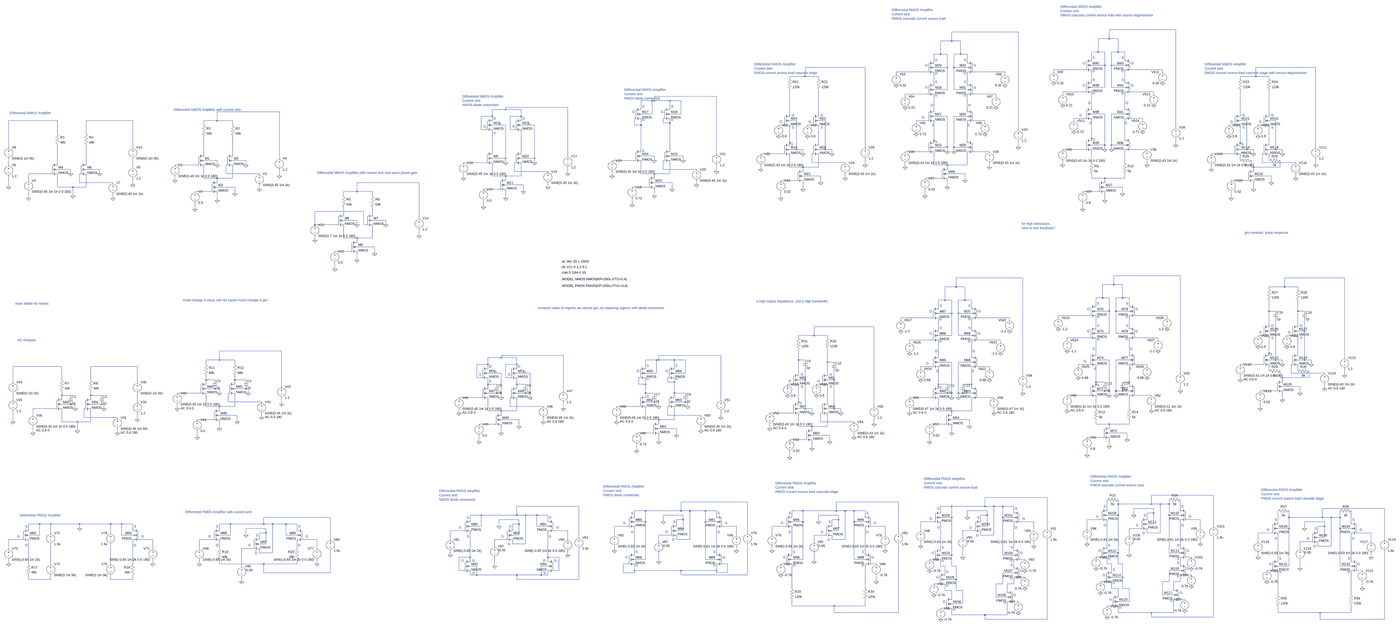
[diagram p0: schematic Draft3.asc, whole sheet]
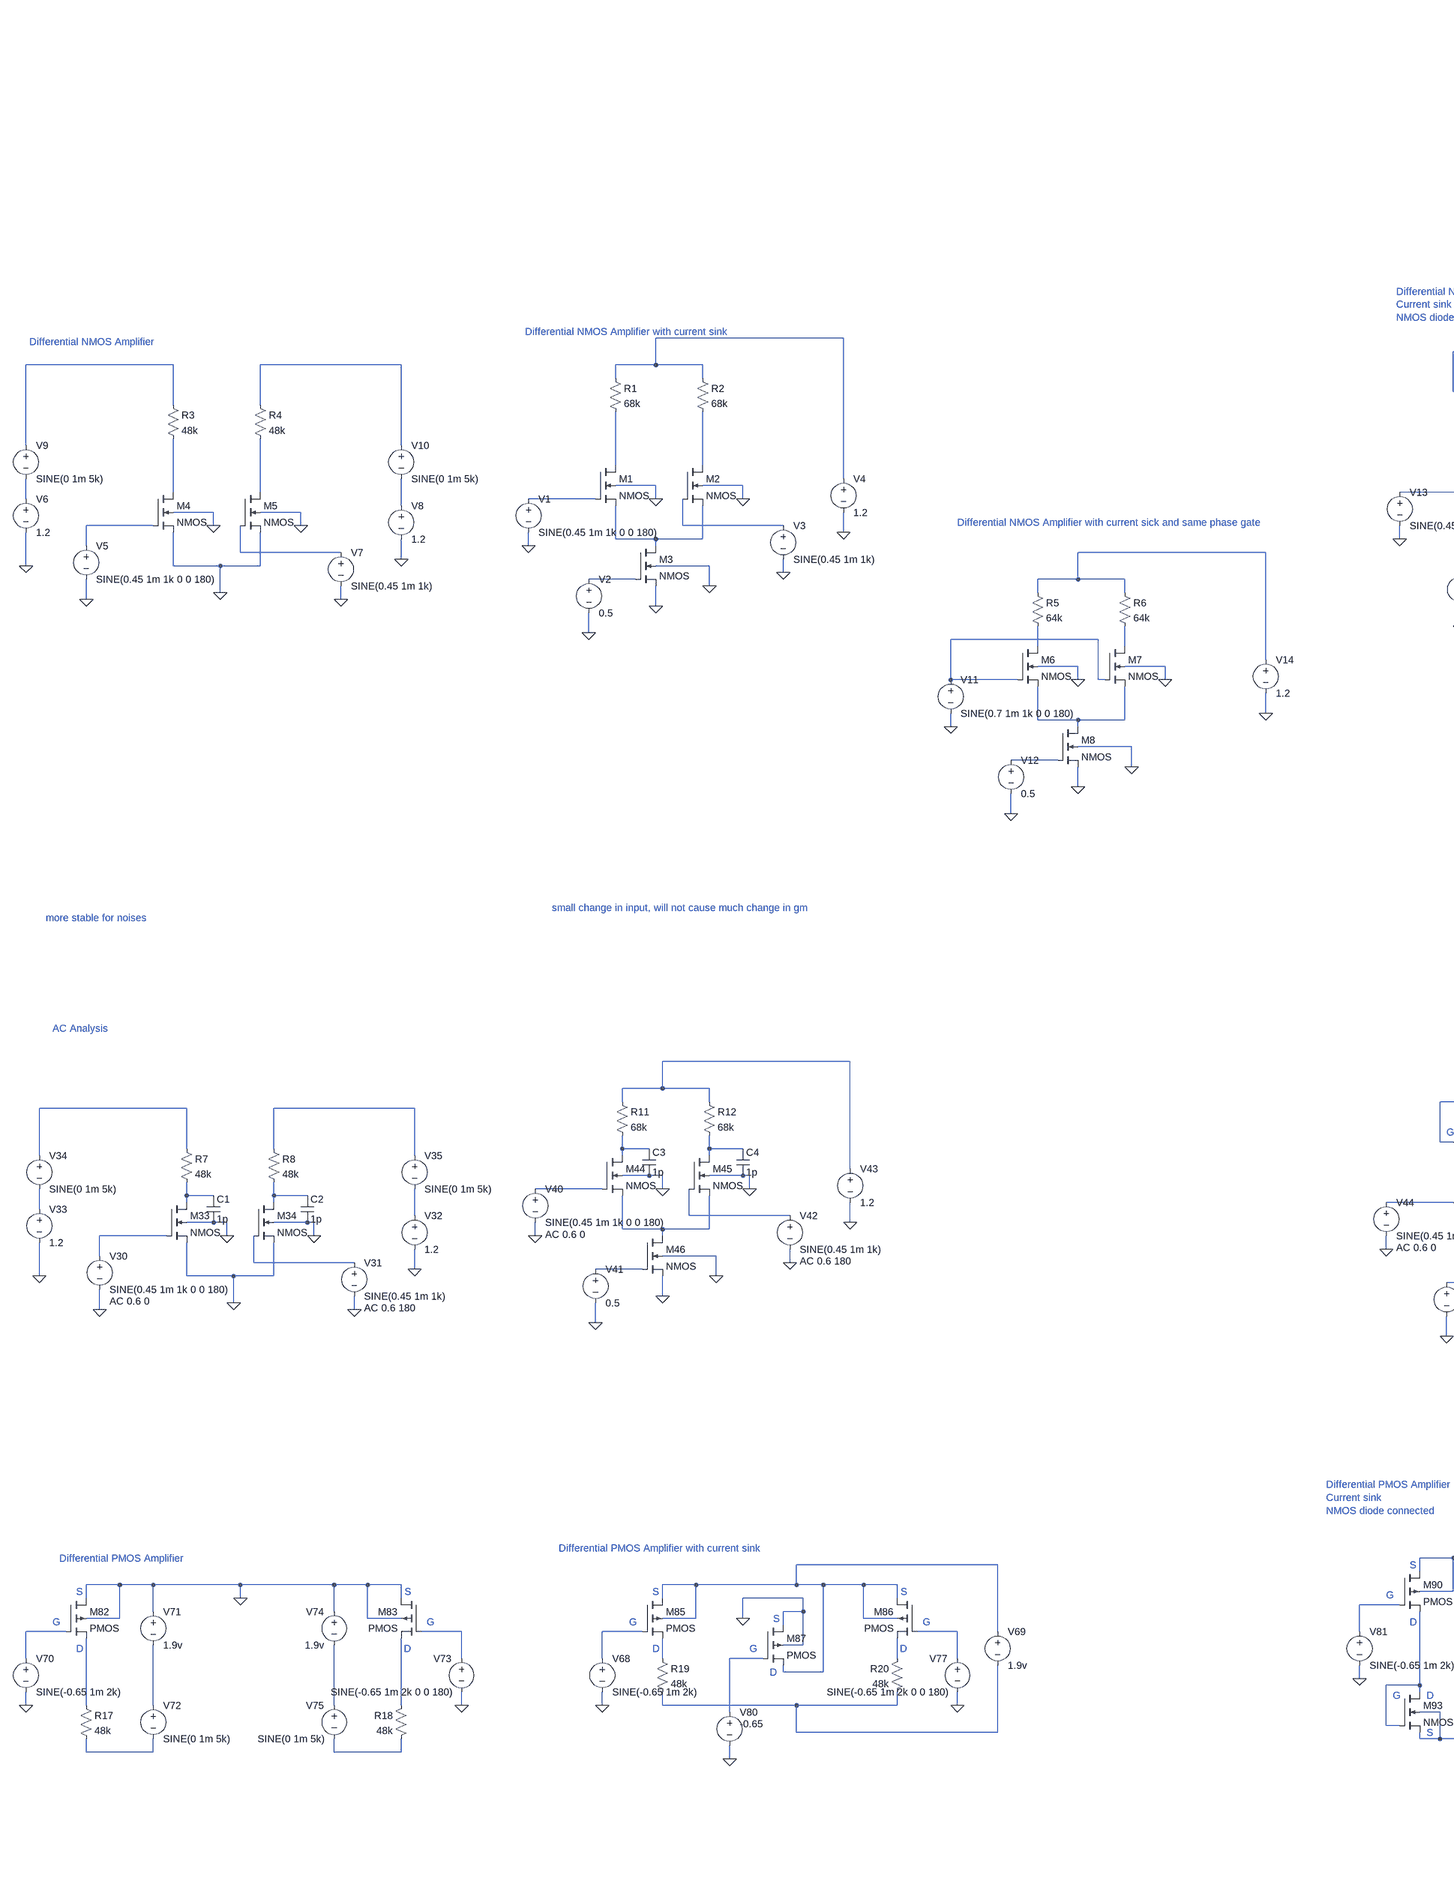
[diagram p1: schematic Draft3.asc, part, row 1 of 1, column 1 of 3]
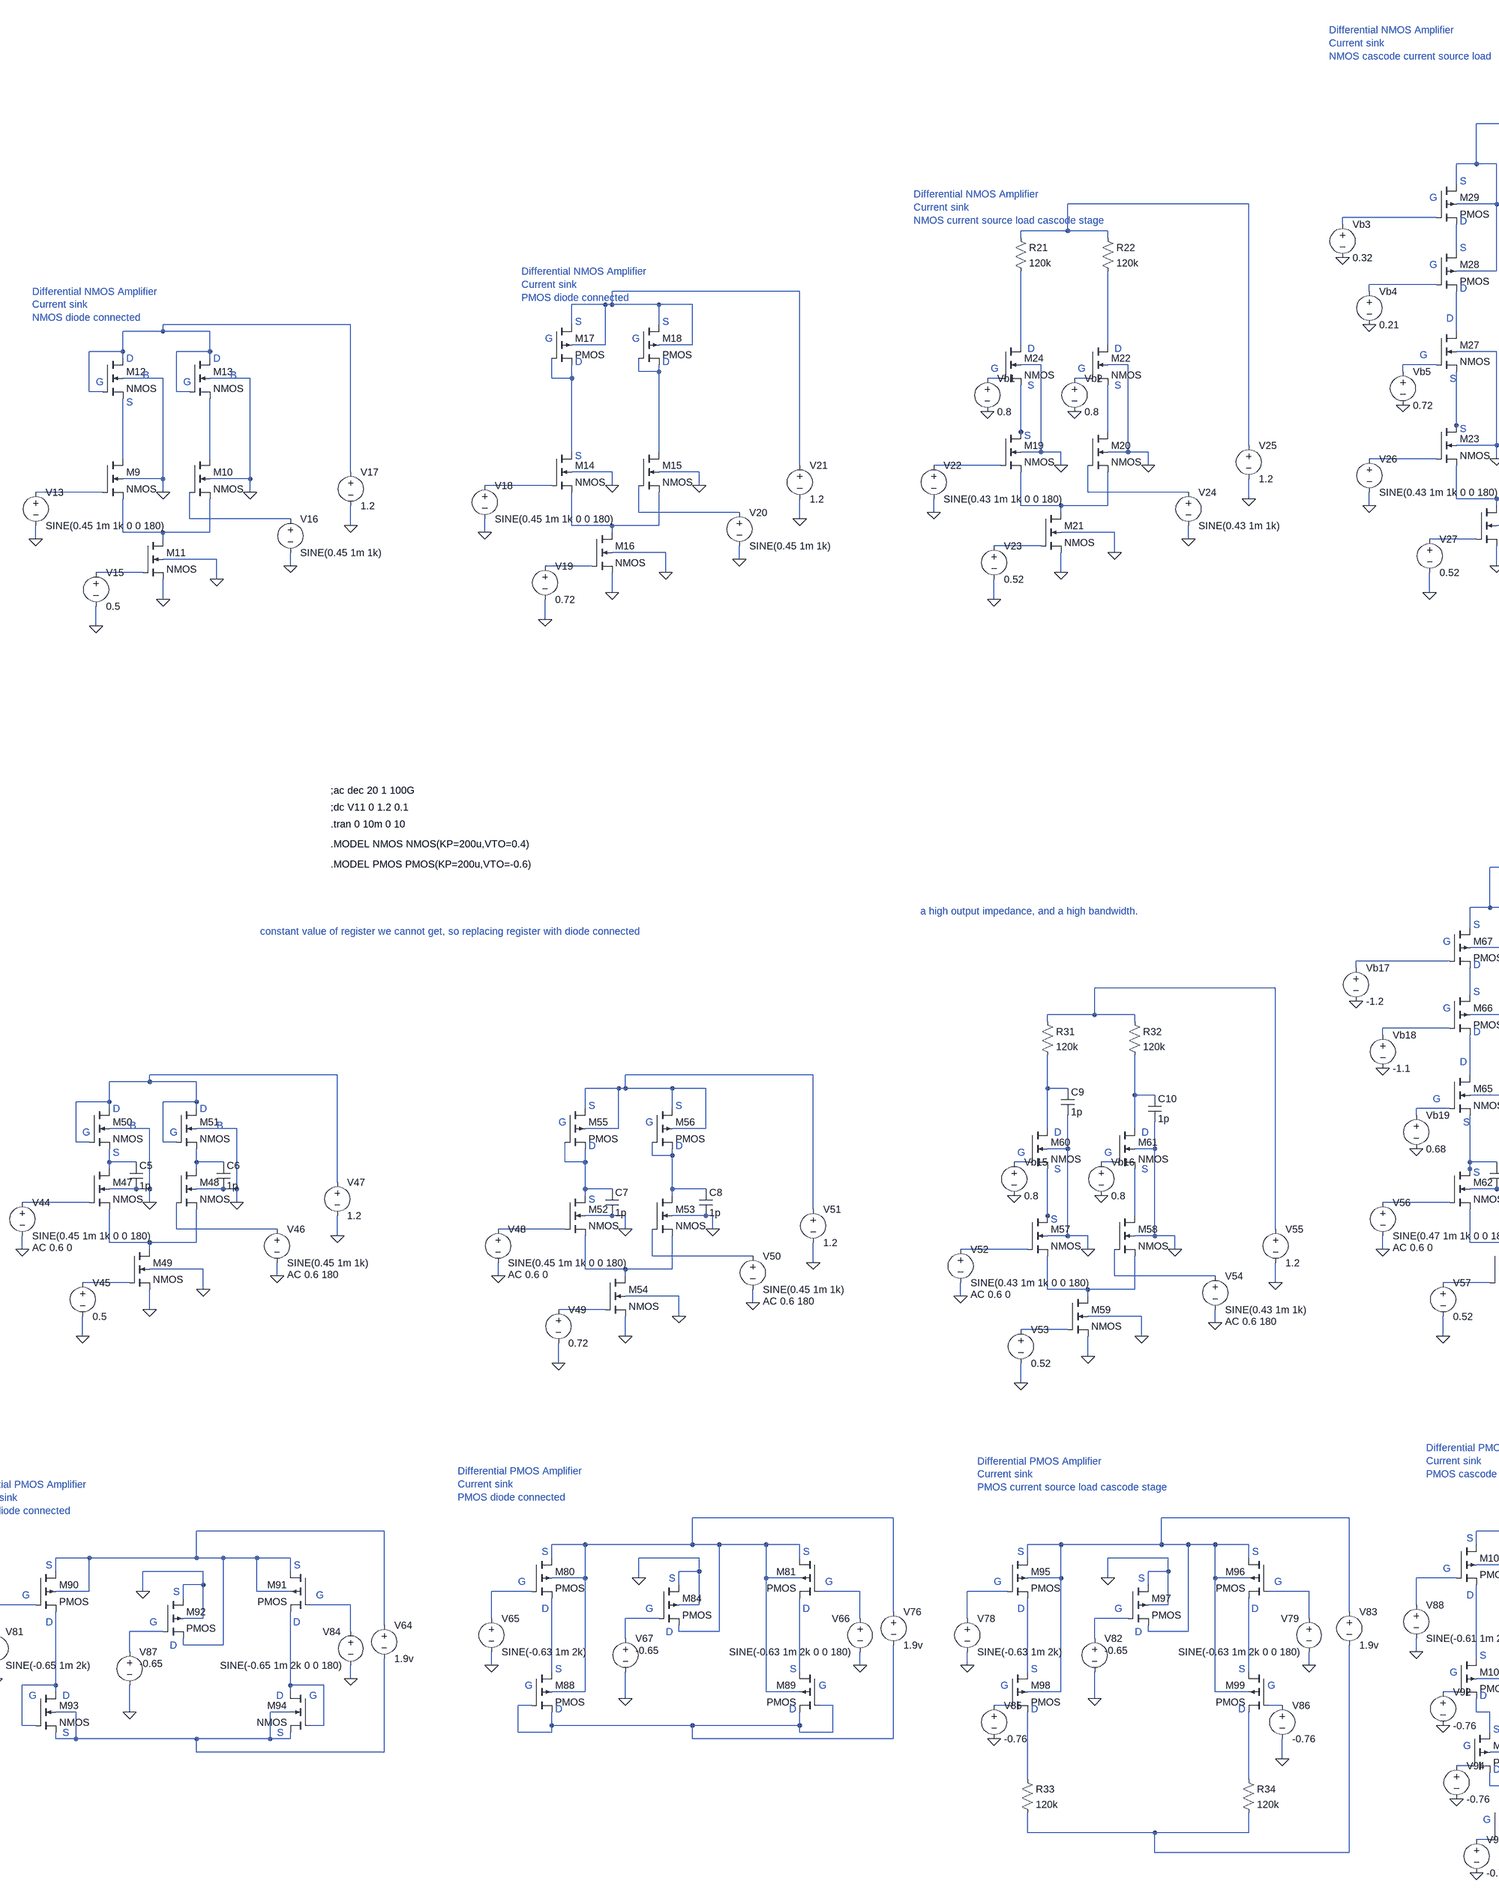
[diagram p2: schematic Draft3.asc, part, row 1 of 1, column 2 of 3]
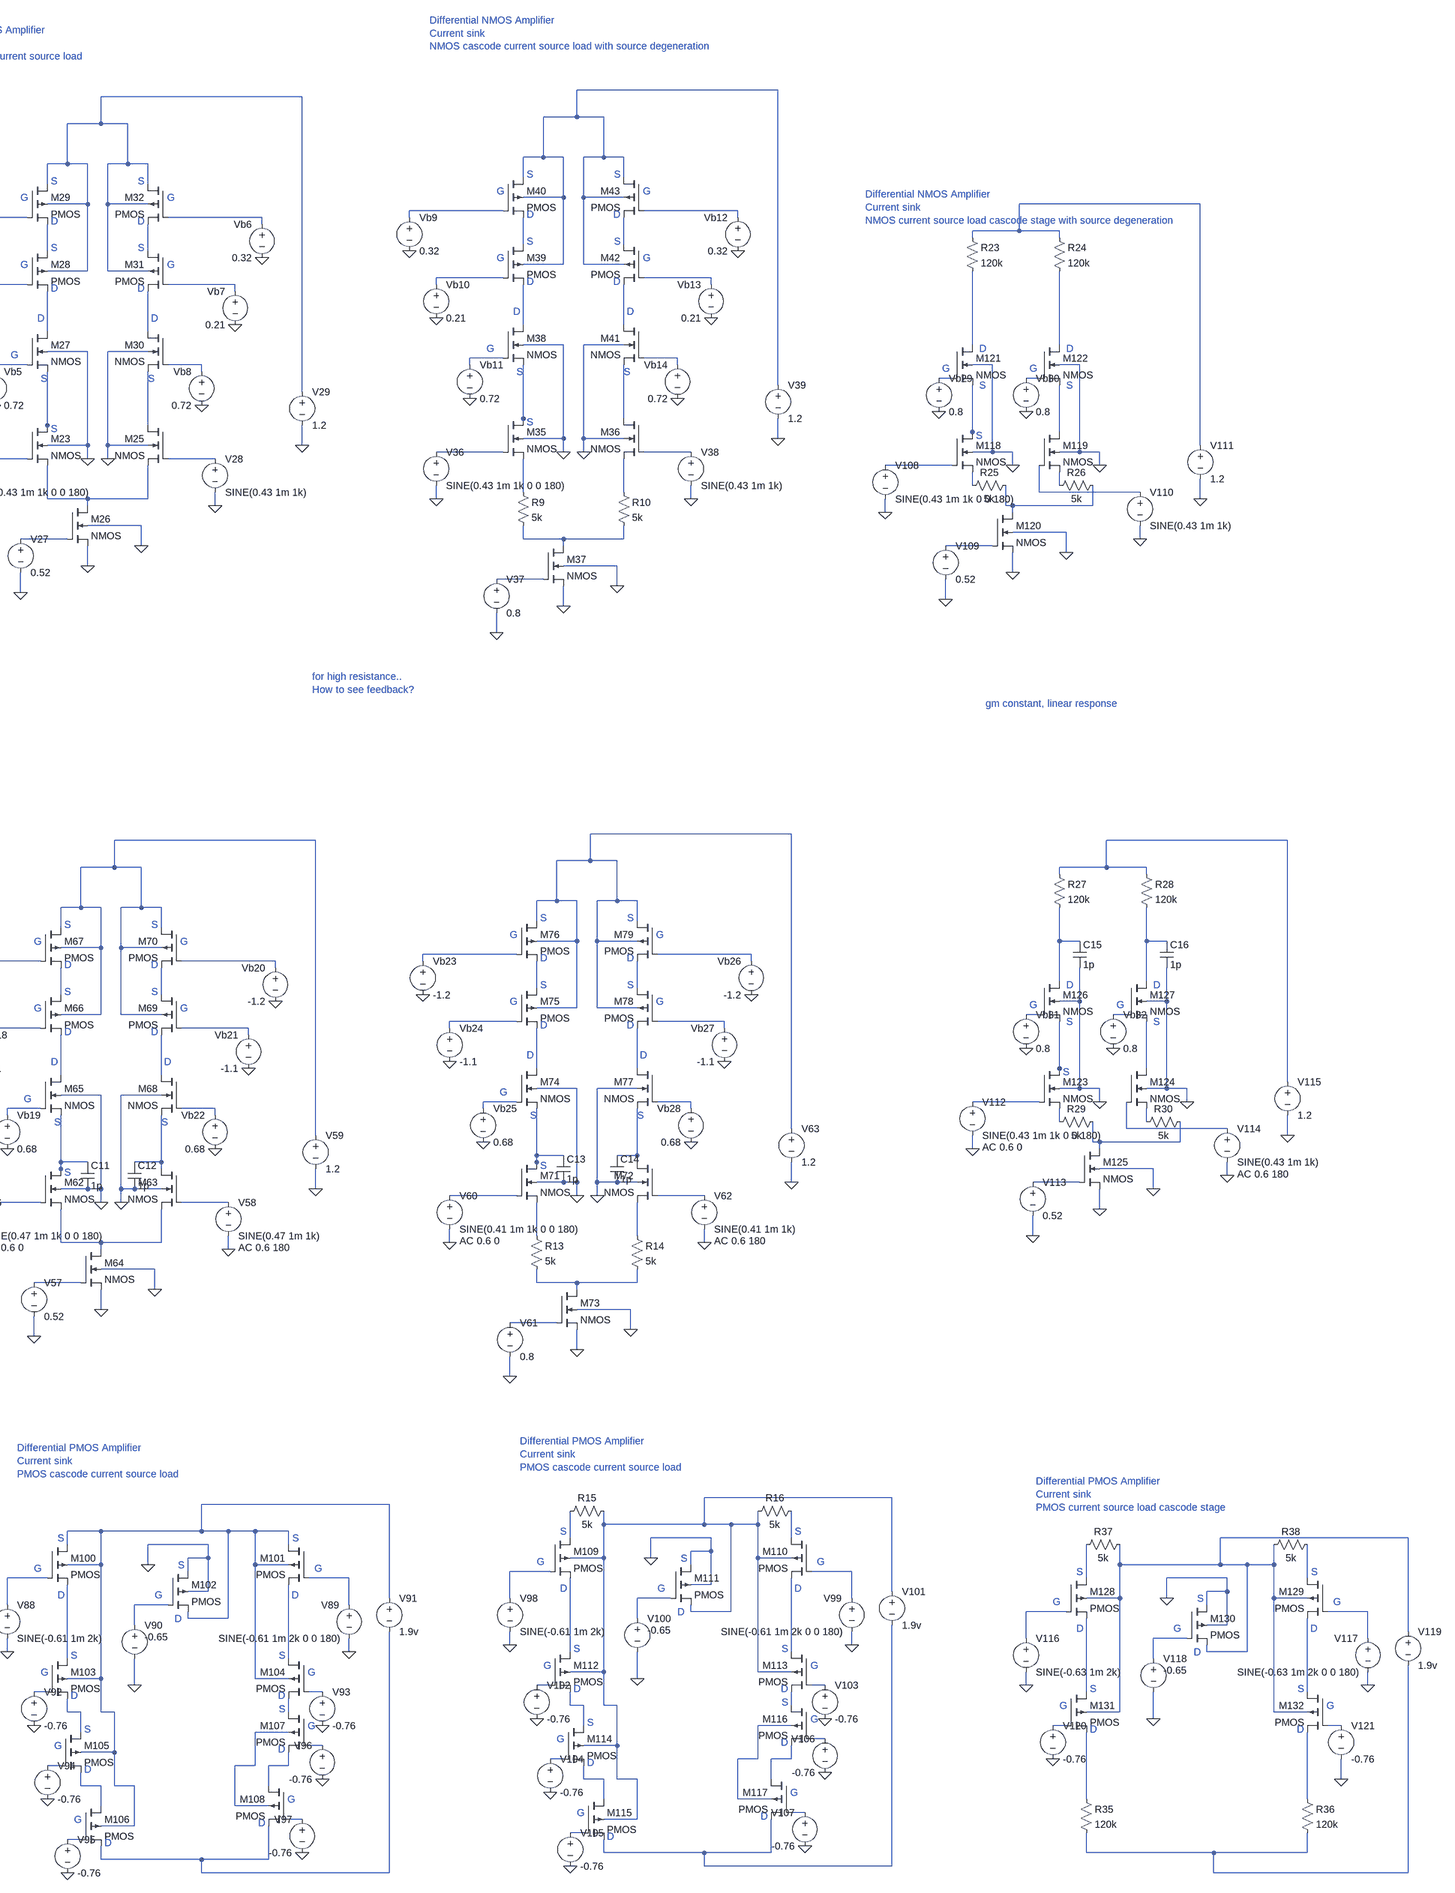
[diagram p3: schematic Draft3.asc, part, row 1 of 1, column 3 of 3]
* Draft3.asc
M1 N054 N069 N080 0 NMOS l=1u w=60u
M2 N055 N077 N080 0 NMOS l=1u w=60u
M3 N080 N089 0 0 NMOS
V1 N069 0 SINE(0.45 1m 1k 0 0 180)
V2 N089 0 0.5
V3 N077 0 SINE(0.45 1m 1k)
V4 N023 0 1.2
R1 N023 N054 68k
R2 N023 N055 68k
M4 N061 N076 0 0 NMOS l=1u w=60u
M5 N062 N085 0 0 NMOS l=1u w=60u
V5 N076 0 SINE(0.45 1m 1k 0 0 180)
V7 N085 0 SINE(0.45 1m 1k)
V8 N071 0 1.2
R3 N030 N061 48k
R4 N031 N062 48k
V6 N068 0 1.2
V9 N030 N068 SINE(0 1m 5k)
V10 N031 N071 SINE(0 1m 5k)
M6 N092 N091 N094 0 NMOS l=1u w=100u
M7 N093 N091 N094 0 NMOS l=1u w=100u
M8 N094 N095 0 0 NMOS
V11 N091 0 SINE(0.7 1m 1k 0 0 180)
V12 N095 0 0.5
V14 N086 0 1.2
R5 N086 N092 64k
R6 N086 N093 64k
M9 N050 N063 N079 0 NMOS l=1u w=100u
M10 N051 N075 N079 0 NMOS l=1u w=100u
M11 N079 N088 0 0 NMOS l=1u w=100u
V13 N063 0 SINE(0.45 1m 1k 0 0 180)
V15 N088 0 0.5
V16 N075 0 SINE(0.45 1m 1k)
V17 N018 0 1.2
M12 N018 N018 N050 0 NMOS l=1u w=10u
M13 N018 N018 N051 0 NMOS l=1u w=10u
M14 N035 N058 N078 0 NMOS l=1u w=100u
M15 N034 N074 N078 0 NMOS l=1u w=100u
M16 N078 N087 0 0 NMOS l=1u w=10u
V18 N058 0 SINE(0.45 1m 1k 0 0 180)
V19 N087 0 0.72
V20 N074 0 SINE(0.45 1m 1k)
V21 N017 0 1.2
M17 N017 N035 N035 N017 PMOS l=1u w=10u
M18 N017 N034 N034 N017 PMOS l=1u w=10u
M19 N044 N056 N072 0 NMOS l=1u w=100u
M20 N045 N064 N072 0 NMOS l=1u w=100u
M21 N072 N083 0 0 NMOS l=1u w=10u
V22 N056 0 SINE(0.43 1m 1k 0 0 180)
V23 N083 0 0.52
V24 N064 0 SINE(0.43 1m 1k)
V25 N003 0 1.2
M24 N024 N036 N044 0 NMOS l=1u w=20u
Vb1 N036 0 0.8
M22 N025 N037 N045 0 NMOS l=1u w=20u
Vb2 N037 0 0.8
M23 N042 N052 N070 0 NMOS l=1u w=100u
M25 N043 N053 N070 0 NMOS l=1u w=100u
M26 N070 N081 0 0 NMOS l=1u w=10u
V26 N052 0 SINE(0.43 1m 1k 0 0 180)
V27 N081 0 0.52
V28 N053 0 SINE(0.43 1m 1k)
V29 N002 0 1.2
M27 N021 N032 N042 0 NMOS l=1u w=20u
M28 N011 N015 N021 N002 PMOS l=2u w=30u
M29 N002 N007 N011 N002 PMOS l=4u w=10u
Vb3 N007 0 0.32
Vb4 N015 0 0.21
Vb5 N032 0 0.72
M30 N022 N033 N043 0 NMOS l=1u w=100u
M31 N012 N016 N022 N002 PMOS l=2u w=30u
M32 N002 N008 N012 N002 PMOS l=4u w=10u
Vb6 N008 0 0.32
Vb7 N016 0 0.21
Vb8 N033 0 0.72
M33 N152 N167 0 0 NMOS l=1u w=60u
M34 N153 N174 0 0 NMOS l=1u w=60u
V30 N167 0 SINE(0.45 1m 1k 0 0 180) AC 0.6 0
V31 N174 0 SINE(0.45 1m 1k) AC 0.6 180
V32 N160 0 1.2
R7 N130 N152 48k
R8 N131 N153 48k
V33 N159 0 1.2
V34 N130 N159 SINE(0 1m 5k)
V35 N131 N160 SINE(0 1m 5k)
C1 N152 0 1p
C2 N153 0 1p
M35 N040 N048 N065 0 NMOS l=1u w=100u
M36 N041 N049 N066 0 NMOS l=1u w=100u
M37 N082 N090 0 0 NMOS l=1u w=100u
V36 N048 0 SINE(0.43 1m 1k 0 0 180)
V37 N090 0 0.8
V38 N049 0 SINE(0.43 1m 1k)
V39 N001 0 1.2
M38 N019 N028 N040 0 NMOS l=1u w=10u
M39 N009 N013 N019 N001 PMOS l=2u w=30u
M40 N001 N005 N009 N001 PMOS l=4u w=10u
Vb9 N005 0 0.32
Vb10 N013 0 0.21
Vb11 N028 0 0.72
M41 N020 N029 N041 0 NMOS l=1u w=10u
M42 N010 N014 N020 N001 PMOS l=2u w=30u
M43 N001 N006 N010 N001 PMOS l=4u w=10u
Vb12 N006 0 0.32
Vb13 N014 0 0.21
Vb14 N029 0 0.72
R9 N065 N082 5k
R10 N066 N082 5k
M44 N138 N151 N164 0 NMOS l=1u w=60u
M45 N139 N161 N164 0 NMOS l=1u w=60u
M46 N164 N175 0 0 NMOS l=1u w=100u
V40 N151 0 SINE(0.45 1m 1k 0 0 180) AC 0.6 0
V41 N175 0 0.5
V42 N161 0 SINE(0.45 1m 1k) AC 0.6 180
V43 N116 0 1.2
R11 N116 N138 68k
R12 N116 N139 68k
C3 N138 0 1p
C4 N139 0 1p
M47 N143 N156 N170 0 NMOS l=1u w=100u
M48 N144 N165 N170 0 NMOS l=1u w=100u
M49 N170 N178 0 0 NMOS l=1u w=100u
V44 N156 0 SINE(0.45 1m 1k 0 0 180) AC 0.6 0
V45 N178 0 0.5
V46 N165 0 SINE(0.45 1m 1k) AC 0.6 180
V47 N121 0 1.2
M50 N121 N121 N143 0 NMOS l=1u w=10u
M51 N121 N121 N144 0 NMOS l=1u w=10u
C5 N143 0 1p
C6 N144 0 1p
M52 N145 N166 N176 0 NMOS l=1u w=100u
M53 N140 N173 N176 0 NMOS l=1u w=100u
M54 N176 N182 0 0 NMOS l=1u w=10u
V48 N166 0 SINE(0.45 1m 1k 0 0 180) AC 0.6 0
V49 N182 0 0.72
V50 N173 0 SINE(0.45 1m 1k) AC 0.6 180
V51 N122 0 1.2
M55 N122 N145 N145 N122 PMOS l=1u w=10u
M56 N122 N140 N140 N122 PMOS l=1u w=10u
M62 N148 N157 N171 0 NMOS l=1u w=100u
M63 N149 N158 N171 0 NMOS l=1u w=100u
M64 N171 N179 0 0 NMOS l=1u w=10u
V56 N157 0 SINE(0.47 1m 1k 0 0 180) AC 0.6 0
V57 N179 0 0.52
V58 N158 0 SINE(0.47 1m 1k) AC 0.6 180
V59 N097 0 1.2
M65 N123 N132 N148 0 NMOS l=1u w=10u
M66 N108 N114 N123 N097 PMOS l=1u w=10u
M67 N097 N103 N108 N097 PMOS l=2u w=10u
Vb17 N103 0 -1.2
Vb18 N114 0 -1.1
Vb19 N132 0 0.68
M68 N124 N133 N149 0 NMOS l=1u w=10u
M69 N109 N115 N124 N097 PMOS l=1u w=10u
M70 N097 N104 N109 N097 PMOS l=2u w=10u
Vb20 N104 0 -1.2
Vb21 N115 0 -1.1
Vb22 N133 0 0.68
M71 N141 N154 N168 0 NMOS l=1u w=120u
M72 N142 N155 N169 0 NMOS l=1u w=120u
M73 N180 N183 0 0 NMOS l=1u w=10u
V60 N154 0 SINE(0.41 1m 1k 0 0 180) AC 0.6 0
V61 N183 0 0.8
V62 N155 0 SINE(0.41 1m 1k) AC 0.6 180
V63 N096 0 1.2
M74 N117 N127 N141 0 NMOS l=1u w=10u
M75 N106 N112 N117 N096 PMOS l=1u w=10u
M76 N096 N101 N106 N096 PMOS l=2u w=10u
Vb23 N101 0 -1.2
Vb24 N112 0 -1.1
Vb25 N127 0 0.68
M77 N118 N128 N142 0 NMOS l=1u w=10u
M78 N107 N113 N118 N096 PMOS l=1u w=10u
M79 N096 N102 N107 N096 PMOS l=2u w=10u
Vb26 N102 0 -1.2
Vb27 N113 0 -1.1
Vb28 N128 0 0.68
R13 N168 N180 5k
R14 N169 N180 5k
C7 N145 0 1p
C8 N140 0 1p
C11 N148 0 1p
C12 N149 0 1p
C13 N141 0 1p
C14 N142 0 1p
M82 0 N212 N237 0 PMOS l=1u w=100u
V70 N212 0 SINE(-0.65 1m 2k)
V71 0 N238 1.9v
R17 N237 N256 48k
V72 N238 N256 SINE(0 1m 5k)
M83 0 N213 N240 0 PMOS l=1u w=100u
V73 N213 0 SINE(-0.65 1m 2k 0 0 180)
V74 0 N239 1.9v
R18 N240 N257 48k
V75 N239 N257 SINE(0 1m 5k)
M85 N193 N214 N220 N193 PMOS l=1u w=100u
V68 N214 0 SINE(-0.65 1m 2k)
R19 N220 N241 48k
M86 N193 N215 N222 N193 PMOS l=1u w=100u
V77 N215 0 SINE(-0.65 1m 2k 0 0 180)
R20 N222 N241 48k
M87 0 N221 N193 0 PMOS l=1u w=100u
V80 N221 0 -0.65
M90 N189 N205 N229 N189 PMOS l=1u w=100u
V81 N205 0 SINE(-0.65 1m 2k)
M91 N189 N206 N230 N189 PMOS l=1u w=100u
V84 N206 0 SINE(-0.65 1m 2k 0 0 180)
M92 0 N216 N189 0 PMOS l=1u w=20u
V87 N216 0 -0.65
M93 N229 N229 N247 N247 NMOS l=1u w=20u
M94 N230 N230 N247 N247 NMOS l=1u w=20u
V69 N193 N241 1.9v
V64 N189 N247 1.9v
M80 N187 N200 N225 N187 PMOS l=1u w=100u
V65 N200 0 SINE(-0.63 1m 2k)
M81 N187 N201 N226 N187 PMOS l=1u w=100u
V66 N201 0 SINE(-0.63 1m 2k 0 0 180)
M84 0 N210 N187 0 PMOS l=1u w=100u
V67 N210 0 -0.65
V76 N187 N242 1.9v
M88 N225 N242 N242 N187 PMOS l=1u w=10u
M89 N226 N242 N242 N187 PMOS l=1u w=10u
M95 N188 N202 N227 N188 PMOS l=1u w=100u
V78 N202 0 SINE(-0.63 1m 2k)
M96 N188 N203 N228 N188 PMOS l=1u w=100u
V79 N203 0 SINE(-0.63 1m 2k 0 0 180)
M97 0 N211 N188 0 PMOS l=1u w=100u
V82 N211 0 -0.65
V83 N188 N270 1.9v
M98 N227 N243 N262 N188 PMOS l=1u w=10u
M99 N228 N244 N263 N188 PMOS l=1u w=10u
V85 N243 0 -0.76
V86 N244 0 -0.76
M100 N186 N196 N223 N186 PMOS l=1u w=100u
V88 N196 0 SINE(-0.61 1m 2k)
M101 N186 N197 N224 N186 PMOS l=1u w=100u
V89 N197 0 SINE(-0.61 1m 2k 0 0 180)
M102 0 N207 N186 0 PMOS l=1u w=100u
V90 N207 0 -0.65
V91 N186 N275 1.9v
M103 N223 N233 N248 N186 PMOS l=1u w=10u
M104 N224 N234 N249 N186 PMOS l=1u w=10u
V92 N233 0 -0.76
V93 N234 0 -0.76
M105 N248 N260 N265 N186 PMOS l=1u w=10u
V94 N260 0 -0.76
M106 N265 N272 N275 N186 PMOS l=1u w=10u
V95 N272 0 -0.76
M107 N249 N255 N261 N253 PMOS l=1u w=10u
V96 N255 0 -0.76
M108 N261 N269 N275 N253 PMOS l=1u w=10u
V97 N269 0 -0.76
M109 N190 N194 N218 N185 PMOS l=1u w=100u
V98 N194 0 SINE(-0.61 1m 2k)
M110 N191 N195 N219 N185 PMOS l=1u w=100u
V99 N195 0 SINE(-0.61 1m 2k 0 0 180)
M111 0 N204 N185 0 PMOS l=1u w=100u
V100 N204 0 -0.65
V101 N185 N273 1.9v
M112 N218 N231 N245 N185 PMOS l=1u w=10u
M113 N219 N232 N246 N185 PMOS l=1u w=10u
V102 N231 0 -0.76
V103 N232 0 -0.76
M114 N245 N258 N264 N185 PMOS l=1u w=10u
V104 N258 0 -0.76
M115 N264 N271 N273 N185 PMOS l=1u w=10u
V105 N271 0 -0.76
M116 N246 N254 N259 N250 PMOS l=1u w=10u
V106 N254 0 -0.76
M117 N259 N268 N273 N250 PMOS l=1u w=10u
V107 N268 0 -0.76
R15 N185 N190 5k
R16 N191 N185 5k
R21 N003 N024 120k
R22 N003 N025 120k
M118 N046 N057 N059 0 NMOS l=1u w=100u
M119 N047 N067 N060 0 NMOS l=1u w=100u
M120 N073 N084 0 0 NMOS l=1u w=10u
V108 N057 0 SINE(0.43 1m 1k 0 0 180)
V109 N084 0 0.52
V110 N067 0 SINE(0.43 1m 1k)
V111 N004 0 1.2
M121 N026 N038 N046 0 NMOS l=1u w=20u
Vb29 N038 0 0.8
M122 N027 N039 N047 0 NMOS l=1u w=20u
Vb30 N039 0 0.8
R23 N004 N026 120k
R24 N004 N027 120k
R25 N073 N059 5k
R26 N073 N060 5k
M123 N119 N129 N134 0 NMOS l=1u w=100u
M124 N120 N136 N135 0 NMOS l=1u w=100u
M125 N137 N150 0 0 NMOS l=1u w=10u
V112 N129 0 SINE(0.43 1m 1k 0 0 180) AC 0.6 0
V113 N150 0 0.52
V114 N136 0 SINE(0.43 1m 1k) AC 0.6 180
V115 N098 0 1.2
M126 N099 N110 N119 0 NMOS l=1u w=20u
Vb31 N110 0 0.8
M127 N100 N111 N120 0 NMOS l=1u w=20u
Vb32 N111 0 0.8
R27 N098 N099 120k
R28 N098 N100 120k
R29 N137 N134 5k
R30 N137 N135 5k
C15 N099 0 1p
C16 N100 0 1p
M57 N162 N172 N181 0 NMOS l=1u w=100u
M58 N163 N177 N181 0 NMOS l=1u w=100u
M59 N181 N184 0 0 NMOS l=1u w=10u
V52 N172 0 SINE(0.43 1m 1k 0 0 180) AC 0.6 0
V53 N184 0 0.52
V54 N177 0 SINE(0.43 1m 1k) AC 0.6 180
V55 N105 0 1.2
M60 N125 N146 N162 0 NMOS l=1u w=20u
Vb15 N146 0 0.8
M61 N126 N147 N163 0 NMOS l=1u w=20u
Vb16 N147 0 0.8
R31 N105 N125 120k
R32 N105 N126 120k
C9 N125 0 1p
C10 N126 0 1p
R33 N262 N270 120k
R34 N263 N270 120k
M128 N198 N208 N235 N192 PMOS l=1u w=100u
V116 N208 0 SINE(-0.63 1m 2k)
M129 N199 N209 N236 N192 PMOS l=1u w=100u
V117 N209 0 SINE(-0.63 1m 2k 0 0 180)
M130 0 N217 N192 0 PMOS l=1u w=100u
V118 N217 0 -0.65
V119 N192 N274 1.9v
M131 N235 N251 N266 N192 PMOS l=1u w=10u
M132 N236 N252 N267 N192 PMOS l=1u w=10u
V120 N251 0 -0.76
V121 N252 0 -0.76
R35 N266 N274 120k
R36 N267 N274 120k
R37 N192 N198 5k
R38 N199 N192 5k
.model NMOS NMOS
.model PMOS PMOS
.lib standard.mos
.MODEL NMOS NMOS(KP=200u,VTO=0.4)
;dc V11 0 1.2 0.1
.tran 0 10m 0 10
* D
* G
* S
* B
* D
* G
* B
* S
.MODEL PMOS PMOS(KP=200u,VTO=-0.6)
* D
* G
* S
* D
* G
* S
* S
* S
* D
* G
* S
* D
* G
* S
* D
* G
* S
* D
* G
* S
* D
* G
* S
* D
* S
* D
* G
* S
* D
* G
* S
;ac dec 20 1 100G
* S
* D
* G
* S
* D
* G
* S
* D
* G
* S
* D
* S
* D
* G
* S
* D
* G
* S
* D
* G
* S
* B
* D
* G
* B
* S
* D
* G
* S
* D
* G
* S
* S
* D
* G
* S
* D
* G
* S
* D
* G
* S
* D
* S
* D
* G
* S
* D
* G
* S
* S
* D
* G
* S
* D
* G
* S
* D
* G
* S
* D
* S
* D
* G
* S
* D
* G
* S
* Differential NMOS Amplifier
* Differential NMOS Amplifier with current sink
* Differential NMOS Amplifier with current sick and same phase gate
* Differential NMOS Amplifier
* Current sink
* NMOS diode connected
* Differential NMOS Amplifier
* Current sink
* PMOS diode connected
* Differential NMOS Amplifier
* Current sink
* NMOS current source load cascode stage
* Differential NMOS Amplifier
* Current sink
* NMOS cascode current source load
* Differential NMOS Amplifier
* Current sink
* NMOS cascode current source load with source degeneration
* AC Analysis
* Differential PMOS Amplifier
* D
* G
* S
* D
* G
* S
* Differential PMOS Amplifier with current sink
* D
* G
* S
* D
* G
* S
* G
* S
* D
* D
* G
* S
* D
* G
* S
* G
* S
* D
* S
* D
* G
* S
* D
* G
* Differential PMOS Amplifier
* Current sink
* NMOS diode connected
* D
* G
* S
* D
* G
* S
* G
* S
* D
* Differential PMOS Amplifier
* Current sink
* PMOS diode connected
* D
* G
* S
* D
* G
* S
* D
* G
* S
* D
* G
* S
* G
* S
* D
* Differential PMOS Amplifier
* Current sink
* PMOS current source load cascode stage
* D
* G
* S
* D
* G
* S
* D
* G
* S
* D
* G
* S
* G
* S
* D
* Differential PMOS Amplifier
* Current sink
* PMOS cascode current source load
* D
* G
* S
* D
* G
* S
* D
* G
* S
* D
* G
* D
* G
* S
* D
* G
* D
* G
* S
* D
* G
* S
* G
* S
* D
* Differential PMOS Amplifier
* Current sink
* PMOS cascode current source load
* D
* G
* S
* D
* G
* S
* D
* G
* S
* D
* G
* D
* G
* S
* D
* G
* more stable for noises
* small change in input, will not cause much change in gm
* constant value of register we cannot get, so replacing register with diode connected
* a high output impedance, and a high bandwidth.
* for high resistance..
* How to see feedback?
* S
* S
* D
* G
* S
* D
* G
* Differential NMOS Amplifier
* Current sink
* NMOS current source load cascode stage with source degeneration
* S
* S
* D
* G
* S
* D
* G
* S
* S
* D
* G
* S
* D
* G
* D
* G
* S
* D
* G
* S
* G
* S
* D
* Differential PMOS Amplifier
* Current sink
* PMOS current source load cascode stage
* D
* G
* S
* D
* G
* S
* gm constant, linear response
.backanno
.end